# Altium schematic sheet FC_v2.0_Schematic.SchDoc
size 431 x 292 mm
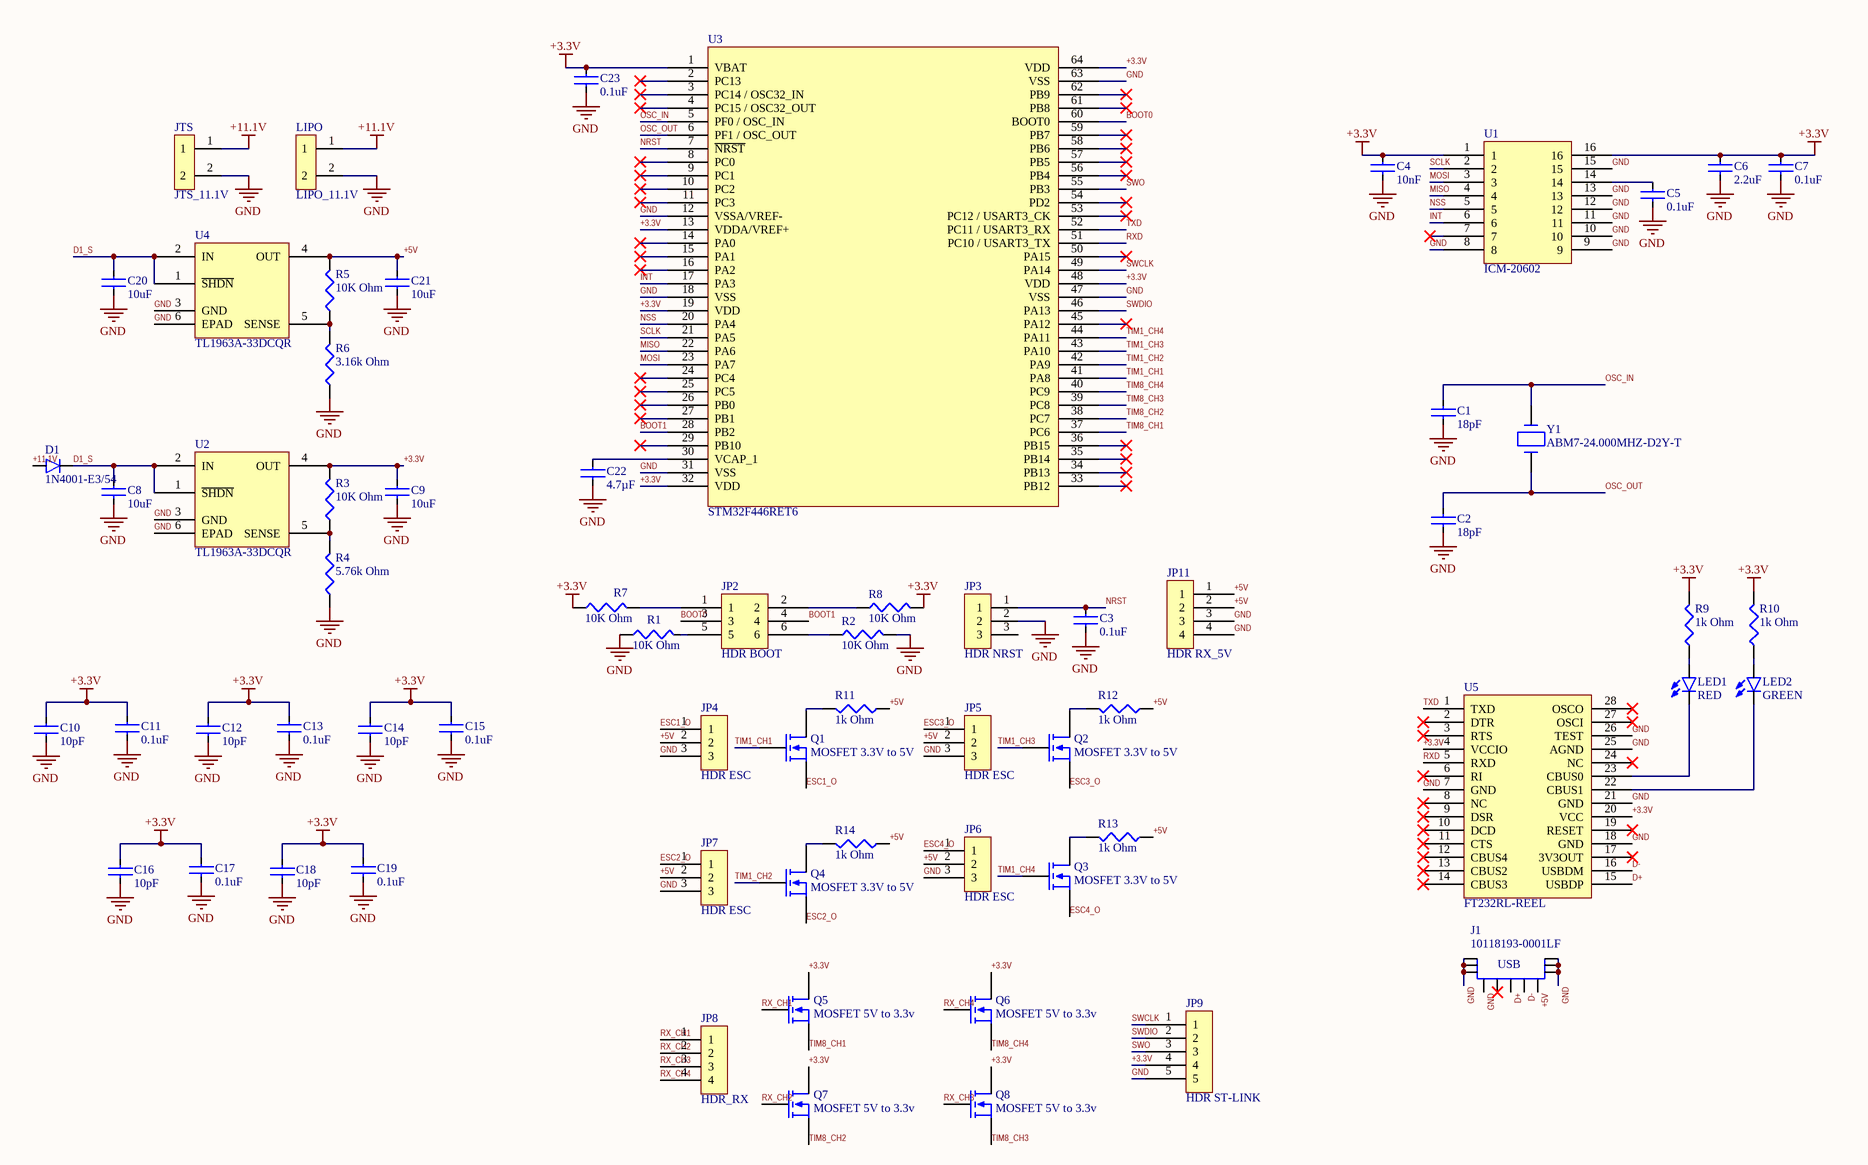
[diagram p0: FC_v2.0_Schematic.SchDoc]

## Parts
C1  18pF  [C0805]
C2  18pF  [C0805]
C3  0.1uF  [C0805]
C4  10nF  [C0805]
C5  0.1uF  [C0805]
C6  2.2uF  [C0805]
C7  0.1uF  [C0805]
C8  10uF  [C0805]
C9  10uF  [C0805]
C10  10pF  [C0805]
C11  0.1uF  [C0805]
C12  10pF  [C0805]
C13  0.1uF  [C0805]
C14  10pF  [C0805]
C15  0.1uF  [C0805]
C16  10pF  [C0805]
C17  0.1uF  [C0805]
C18  10pF  [C0805]
C19  0.1uF  [C0805]
C20  10uF  [C0805]
C21  10uF  [C0805]
C22  4.7µF  [C0805]
C23  0.1uF  [C0805]
D1  1N4001-E3/54  [DIODE]
J1  10118193-0001LF  [10118193]
JP2  HDR BOOT  [HDR_MALE_BOOT]
JP3  HDR NRST  [HDR_Male_NRST]
JP4  HDR ESC  [HDR_Male_ESC]
JP5  HDR ESC  [HDR_Male_ESC]
JP6  HDR ESC  [HDR_Male_ESC]
JP7  HDR ESC  [HDR_Male_ESC]
JP8  HDR_RX  [HDR_Male_RX]
JP9  HDR ST-LINK  [HDR_Male_ST-LINK]
JP11  HDR RX_5V  [HDR_Male_RX_5V]
JTS  JTS_11.1V  [JTS_11.1V]
LED1  RED  [LED]
LED2  GREEN  [LED]
LIPO  LIPO_11.1V  [LIPO_11.1V]
Q1  MOSFET 3.3V to 5V  [MOSFET]
Q2  MOSFET 3.3V to 5V  [MOSFET]
Q3  MOSFET 3.3V to 5V  [MOSFET]
Q4  MOSFET 3.3V to 5V  [MOSFET]
Q5  MOSFET 5V to 3.3v  [MOSFET]
Q6  MOSFET 5V to 3.3v  [MOSFET]
Q7  MOSFET 5V to 3.3v  [MOSFET]
Q8  MOSFET 5V to 3.3v  [MOSFET]
R1  10K Ohm  [R0805]
R2  10K Ohm  [R0805]
R3  10K Ohm  [R0805]
R4  5.76k Ohm  [R0805]
R5  10K Ohm  [R0805]
R6  3.16k Ohm  [R0805]
R7  10K Ohm  [R0805]
R8  10K Ohm  [R0805]
R9  1k Ohm  [R0805]
R10  1k Ohm  [R0805]
R11  1k Ohm  [R0805]
R12  1k Ohm  [R0805]
R13  1k Ohm  [R0805]
R14  1k Ohm  [R0805]
U1  ICM-20602  [LGA]
U2  TL1963A-33DCQR  [DCQ]
U3  STM32F446RET6  [STM32F446xC]
U4  TL1963A-33DCQR  [DCQ]
U5  FT232RL-REEL  [SSOP_28]
Y1  ABM7-24.000MHZ-D2Y-T  [AMB7_v1_0_BIG]

## Nets
+3.3V: C4.1 C6.1 C7.1 C9.1 C10.1 C11.1 C12.1 C13.1 C14.1 C15.1 C16.1 C17.1 C18.1 C19.1 C23.1 JP9.4 Q5.3 Q6.3 Q7.3 Q8.3 R3.2 R7.1 R8.2 R9.2 R10.2 U1.1 U1.16 U2.4(OUT) U3.1(VBAT) U3.13(VDDA/VREF+) U3.19(VDD) U3.32(VDD) U3.48(VDD) U3.64(VDD) U5.4(VCCIO) U5.20(VCC)
+11.1V: D1.1 JTS.1 LIPO.1
GND: C1.2 C2.2 C3.2 C4.2 C5.2 C6.2 C7.2 C8.2 C9.2 C10.2 C11.2 C12.2 C13.2 C14.2 C15.2 C16.2 C17.2 C18.2 C19.2 C20.2 C21.2 C22.2 C23.2 J1.5 J1.6 J1.7 J1.8 J1.9 J1.10 J1.11 JP3.2 JP4.3 JP5.3 JP6.3 JP7.3 JP9.5 JP11.3 JP11.4 JTS.2 LIPO.2 R1.1 R2.1 R4.1 R6.1 U1.8 U1.9 U1.10 U1.11 U1.12 U1.13 U1.15 U2.3(GND) U2.6(EPAD) U3.12(VSSA/VREF-) U3.18(VSS) U3.31(VSS) U3.47(VSS) U3.63(VSS) U4.3(GND) U4.6(EPAD) U5.7(GND) U5.18(GND) U5.21(GND) U5.25(AGND) U5.26(TEST)
+5V: C21.1 J1.1 JP4.2 JP5.2 JP6.2 JP7.2 JP11.1 JP11.2 R5.2 R11.1 R12.1 R13.1 R14.1 U4.4(OUT)
BOOT0: JP2.3 U3.60(BOOT0)
BOOT1: JP2.4 U3.28(PB2)
D1_S: C8.1 C20.1 D1.2 U2.1(~{SHDN}) U2.2(IN) U4.1(~{SHDN}) U4.2(IN)
D+: J1.3 U5.15(USBDP)
D-: J1.2 U5.16(USBDM)
ESC1_O: JP4.1 Q1.2
ESC2_O: JP7.1 Q4.2
ESC3_O: JP5.1 Q2.2
ESC4_O: JP6.1 Q3.2
INT: U1.6 U3.17(PA3)
MISO: U1.4 U3.22(PA6)
MOSI: U1.3 U3.23(PA7)
NRST: C3.1 JP3.1 U3.7(~{NRST})
NSS: U1.5 U3.20(PA4)
OSC_IN: C1.1 U3.5(PF0_/_OSC_IN) Y1.2
OSC_OUT: C2.1 U3.6(PF1_/_OSC_OUT) Y1.1
RX_CH1: JP8.1 Q5.1
RX_CH2: JP8.2 Q7.1
RX_CH3: JP8.3 Q8.1
RX_CH4: JP8.4 Q6.1
RXD: U3.51(PC10_/_USART3_TX) U5.5(RXD)
SCLK: U1.2 U3.21(PA5)
SWCLK: JP9.1 U3.49(PA14)
SWDIO: JP9.2 U3.46(PA13)
SWO: JP9.3 U3.55(PB3)
TIM1_CH1: Q1.1 U3.41(PA8)
TIM1_CH2: Q4.1 U3.42(PA9)
TIM1_CH3: Q2.1 U3.43(PA10)
TIM1_CH4: Q3.1 U3.44(PA11)
TIM8_CH1: Q5.2 U3.37(PC6)
TIM8_CH2: Q7.2 U3.38(PC7)
TIM8_CH3: Q8.2 U3.39(PC8)
TIM8_CH4: Q6.2 U3.40(PC9)
TXD: U3.52(PC11_/_USART3_RX) U5.1(TXD)
NetC5_1: C5.1 U1.14
NetC22_1: C22.1 U3.30(VCAP_1)
NetJP2_1: JP2.1 R7.2
NetJP2_2: JP2.2 R8.1
NetJP2_5: JP2.5 R1.2
NetJP2_6: JP2.6 R2.2
NetLED1_1: LED1.1 R9.1
NetLED1_2: LED1.2 U5.23(CBUS0)
NetLED2_1: LED2.1 R10.1
NetLED2_2: LED2.2 U5.22(CBUS1)
NetQ1_3: Q1.3 R11.2
NetQ2_3: Q2.3 R12.2
NetQ3_3: Q3.3 R13.2
NetQ4_3: Q4.3 R14.2
NetR3_1: R3.1 R4.2 U2.5(SENSE)
NetR5_1: R5.1 R6.2 U4.5(SENSE)

Not connected (* = marked no-connect by the designer): J1 4*; JP3 3; U1 7*; U3 2(PC13)* 3(PC14_/_OSC32_IN)* 4(PC15_/_OSC32_OUT)* 8(PC0)* 9(PC1)* 10(PC2)* 11(PC3)* 14(PA0)* 15(PA1)* 16(PA2)* 24(PC4)* 25(PC5)* 26(PB0)* 27(PB1)* 29(PB10)* 33(PB12)* 34(PB13)* 35(PB14)* 36(PB15)* 45(PA12)* 50(PA15)* 53(PC12_/_USART3_CK)* 54(PD2)* 56(PB4)* 57(PB5)* 58(PB6)* 59(PB7)* 61(PB8)* 62(PB9)*; U5 2(DTR)* 3(RTS)* 6(RI)* 8(NC)* 9(DSR)* 10(DCD)* 11(CTS)* 12(CBUS4)* 13(CBUS2)* 14(CBUS3)* 17(3V3OUT)* 19(RESET)* 24(NC)* 27(OSCI)* 28(OSCO)*

## Notes on the sheet
- (in symbol 10118193-0001LF) USB

## Library data of the parts
C1 C2 = CL21C180JBANNNC: Cap Ceramic 18pF 50V C0G 5% SMD 0805 125C Paper T/R; Manufacturer: Samsung; Supplier 1: Digi-Key; Manufacturer Part Number: CL21C180JBANNNC; Stock 1: 210005; Pricing 1: 1=0.1, 10=0.048, 100=0.0216, 500=0.0154, 1000=0.0121 (USD); Capacitance: 18 pF; Case Size/Dimension: 0805; Dielectric: C0G; Tolerance (%): ±5 %; Rated Voltage: 50 V; ComponentLink1URL: https://datasheet.ciiva.com/25801/cl21c180jbannnc-25801747.pdf; ComponentLink1Description: https://datasheet.ciiva.com/25801/cl21c180jbannnc-25801747.pdf; ComponentLink2URL: https://datasheet.ciiva.com/16216/cl05b104kq5nnnc-16216390.pdf; ComponentLink2Description: https://datasheet.ciiva.com/16216/cl05b104kq5nnnc-16216390.pdf; ComponentLink3URL: https://datasheet.ciiva.com/26838/getdatasheetpartid-666022-26838764.pdf; ComponentLink3Description: https://datasheet.ciiva.com/26838/getdatasheetpartid-666022-26838764.pdf; ComponentLink4URL: https://datasheet.ciiva.com/29199/454764-da-01-en-vs-kondensator-0805-29199527.pdf; ComponentLink4Description: https://datasheet.ciiva.com/29199/454764-da-01-en-vs-kondensator-0805-29199527.pdf; Supplier Part Number 1: 1276-1107-1-ND
C3 C5 C7 C11 C13 C15 C17 C19 C23 = CL21B104KOANNNC: Cap Ceramic 0.1uF 16V X7R 10% SMD 0805 125C Paper T/R; Manufacturer: Samsung; Capacitance: 0.1 µF; Supplier 1: Digi-Key; Manufacturer Part Number: CL21B104KOANNNC; Stock 1: 97502; Pricing 1: 1=0.1, 10=0.03, 100=0.0133, 500=0.0095, 1000=0.0074 (USD); Case Size/Dimension: 0805; Dielectric: X7R; Tolerance (%): ±10 %; Rated Voltage: 16 V; ComponentLink1URL: https://datasheet.ciiva.com/25737/cl21b104koannnc-25737216.pdf; ComponentLink1Description: https://datasheet.ciiva.com/25737/cl21b104koannnc-25737216.pdf; ComponentLink2URL: https://datasheet.ciiva.com/16428/cl21b104koannnc-16428868.pdf; ComponentLink2Description: https://datasheet.ciiva.com/16428/cl21b104koannnc-16428868.pdf; Supplier Part Number 1: 1276-2448-6-ND
C4 = CC0805KRX7R9BB103: CAP CER 10000PF 50V X7R 0805; Manufacturer: Yageo; Product Training Modules: Multilayer Ceramic Capacitors; Catalog Drawings: CC_0805_0.6; Featured Product: Commodity Multilayer Ceramic Capacitors – CC Series; Tolerance: ±10%; Online Catalog: CC Series; Other Names: 311-1136-6; Supplier 1: Digi-Key; Manufacturer Part Number: CC0805KRX7R9BB103; Stock 1: 1187328; Pricing 1: 1=0.1, 10=0.035, 100=0.0158, 500=0.0113, 1000=0.0089 (USD); Standard Package: 1; Category: Capacitors; Family: Ceramic Capacitors; Series: CC; Packaging: Digi-Reel®; Capacitance: 10000pF; Voltage - Rated: 50V; Temperature Coefficient: X7R; Mounting Type: Surface Mount, MLCC; Operating Temperature: -55°C ~ 125°C; Applications: General Purpose; Ratings: -; Package / Case: 0805 (2012 Metric); Size / Dimension: 0.079" L x 0.049" W (2.00mm x 1.25mm); Height - Seated (Max): -; Thickness (Max): 0.024" (0.60mm); Lead Spacing: -; Features: -; Lead Style: -; ComponentLink1URL: https://datasheet.ciiva.com/144/mlccorderingcode-144532.pdf; ComponentLink1Description: https://datasheet.ciiva.com/144/mlccorderingcode-144532.pdf; ComponentLink2URL: https://datasheet.ciiva.com/144/mlccorderingcode-144533.pdf; ComponentLink2Description: https://datasheet.ciiva.com/144/mlccorderingcode-144533.pdf; ComponentLink3URL: https://datasheet.ciiva.com/144/mlccorderingcode-144534.pdf; ComponentLink3Description: https://datasheet.ciiva.com/144/mlccorderingcode-144534.pdf; ComponentLink4URL: https://datasheet.ciiva.com/11786/0900766b80d84f1d-11786119.pdf; ComponentLink4Description: https://datasheet.ciiva.com/11786/0900766b80d84f1d-11786119.pdf; ComponentLink5URL: https://datasheet.ciiva.com/25613/0900766b8027bcf6-25613113.pdf; ComponentLink5Description: https://datasheet.ciiva.com/25613/0900766b8027bcf6-25613113.pdf; ComponentLink6URL: https://datasheet.ciiva.com/16625/upy-gphc-x7r-6-3v-to-50v-8-16625548.pdf; ComponentLink6Description: https://datasheet.ciiva.com/16625/upy-gphc-x7r-6-3v-to-50v-8-16625548.pdf; ComponentLink7URL: https://datasheet.ciiva.com/46372/1784427-46372638.pdf; ComponentLink7Description: https://datasheet.ciiva.com/46372/1784427-46372638.pdf; ComponentLink8URL: https://datasheet.ciiva.com/22749/1489800-22749215.pdf; ComponentLink8Description: https://datasheet.ciiva.com/22749/1489800-22749215.pdf; ComponentLink9URL: https://datasheet.ciiva.com/46372/1734573-46372639.pdf; ComponentLink9Description: https://datasheet.ciiva.com/46372/1734573-46372639.pdf; Supplier Part Number 1: 311-1136-1-ND
C6 = EMK212BJ225KG-T: CAP CER 2.2UF 16V X5R 0805; Manufacturer: Taiyo Yuden; PCN Part Number: X5R, X7R Dielectrics 23/Jan/2008; Catalog Drawings: xMK Series_0805_1.25; Capacitance: 2.2µF; Tolerance: ±10%; Online Catalog: M Series; Kits: 587-1797-KIT-ND  - KIT CAP CER HI CAP 0603 & 0805 S; Other Names: 587-1293-1; Supplier 1: Digi-Key; Manufacturer Part Number: EMK212BJ225KG-T; Stock 1: 391933; Pricing 1: 1=0.16, 10=0.114, 100=0.0534, 500=0.0374, 1000=0.031 (USD); Standard Package: 1; Category: Capacitors; Family: Ceramic Capacitors; Series: M; Packaging: Cut Tape (CT); Voltage - Rated: 16V; Temperature Coefficient: X5R; Mounting Type: Surface Mount, MLCC; Operating Temperature: -55°C ~ 85°C; Applications: General Purpose; Ratings: -; Package / Case: 0805 (2012 Metric); Size / Dimension: 0.079" L x 0.049" W (2.00mm x 1.25mm); Height - Seated (Max): -; Thickness (Max): 0.053" (1.35mm); Lead Spacing: -; Features: -; Lead Style: -; ComponentLink1URL: https://datasheet.ciiva.com/136/emk212bj225kg-t-ss-136098.pdf; ComponentLink1Description: https://datasheet.ciiva.com/136/emk212bj225kg-t-ss-136098.pdf; ComponentLink2URL: https://datasheet.ciiva.com/15920/993emk212bj225kg-t-15920531.pdf; ComponentLink2Description: https://datasheet.ciiva.com/15920/993emk212bj225kg-t-15920531.pdf; ComponentLink3URL: https://datasheet.ciiva.com/26871/getdatasheetpartid-637381-26871380.pdf; ComponentLink3Description: https://datasheet.ciiva.com/26871/getdatasheetpartid-637381-26871380.pdf; ComponentLink4URL: https://datasheet.ciiva.com/5815/1693457-5815977.pdf; ComponentLink4Description: https://datasheet.ciiva.com/5815/1693457-5815977.pdf; ComponentLink5URL: https://datasheet.ciiva.com/30078/125emk212bj225kg-t-30078029.pdf; ComponentLink5Description: https://datasheet.ciiva.com/30078/125emk212bj225kg-t-30078029.pdf; ComponentLink6URL: https://datasheet.ciiva.com/7975/1497285-7975646.pdf; ComponentLink6Description: https://datasheet.ciiva.com/7975/1497285-7975646.pdf; Supplier Part Number 1: 587-1293-1-ND
C8 C9 C20 C21 = CL21A106KOQNNNE: Cap Ceramic 10uF 16V X5R 10% SMD 0805 85C T/R; Manufacturer: Samsung; Capacitance: 10000000 pF; Supplier 1: Digi-Key; Manufacturer Part Number: CL21A106KOQNNNE; Stock 1: 508450; Pricing 1: 1=0.21, 10=0.149, 100=0.0702, 500=0.0492, 1000=0.0408 (USD); Case Size/Dimension: 0805; Dielectric: X5R; Tolerance (%): ±10 %; Rated Voltage: 16 V; ComponentLink1URL: https://datasheet.ciiva.com/25798/cl21a106koqnnne-25798133.pdf; ComponentLink1Description: https://datasheet.ciiva.com/25798/cl21a106koqnnne-25798133.pdf; ComponentLink2URL: https://datasheet.ciiva.com/16740/cl05b104kq5nnnc-16740697.pdf; ComponentLink2Description: https://datasheet.ciiva.com/16740/cl05b104kq5nnnc-16740697.pdf; ComponentLink3URL: https://datasheet.ciiva.com/15216/getdatasheetpartid-358435-15216234.pdf; ComponentLink3Description: https://datasheet.ciiva.com/15216/getdatasheetpartid-358435-15216234.pdf; Supplier Part Number 1: 1276-1096-1-ND
C10 C12 C14 C16 C18 = C0805C100M4GACTU_1: Multilayer Ceramic Capacitors MLCC - SMD/SMT 16volts 10pF C0G 20%; Manufacturer: KEMET; Capacitor Case Style: 0805 [2012 Metric]; Dielectric Characteristic: C0G / NP0; Product Range: KEMET - C Series; SVHC: No SVHC (16-Jun-2014); Voltage Rating: 16V; Supplier 1: Digi-Key; Manufacturer Part Number: C0805C100M4GACTU; Stock 1: 12641; Pricing 1: 1=0.1, 10=0.064, 100=0.0285, 500=0.0204, 1000=0.016 (USD); Capacitance: 10pF; Capacitance Tolerance: ± 20%; Ceramic Capacitor Case: 0805 [2012 Metric]; MSL: MSL 1 - Unlimited; Operating Temperature Max: 125°C; Operating Temperature Min: -55°C; Packaging: Cut Tape; ComponentLink1URL: http://www.kemet.com/Lists/ProductCatalog/Attachments/46/KEM_C1003_C0G_SMD.pdf; ComponentLink1Description: http://www.kemet.com/Lists/ProductCatalog/Attachments/46/KEM_C1003_C0G_SMD.pdf; ComponentLink2URL: http://www.kemet.com/docfinder?Partnumber=C0805C100M4GACTU; ComponentLink2Description: http://www.kemet.com/docfinder?Partnumber=C0805C100M4GACTU; ComponentLink3URL: http://capacitoredge.kemet.com/capedge2/DataSheet?pn=C0805C100M4GACTU; ComponentLink3Description: http://capacitoredge.kemet.com/capedge2/DataSheet?pn=C0805C100M4GACTU; Supplier Part Number 1: 399-9147-1-ND
C22 = CC0805KKX7R8BB475: Multilayer Ceramic Capacitors MLCC - SMD/SMT 4.7M pF 10% 25 Volts; Manufacturer: Yageo; Voltage - Rated: 25V; Temperature Coefficient: X7R; Supplier 1: Digi-Key; Manufacturer Part Number: CC0805KKX7R8BB475; Stock 1: 8314; Pricing 1: 1=0.38, 10=0.263, 100=0.1578, 500=0.1183, 1000=0.0999 (USD); Category: Capacitors; Family: Ceramic Capacitors; Series: CC; Packaging: Tape &amp; Reel (TR); Capacitance: 4.7µF; Tolerance: ±10%; Mounting Type: Surface Mount, MLCC; Operating Temperature: -55°C ~ 125°C; Applications: General Purpose; Ratings: -; Package / Case: 0805 (2012 Metric); Size / Dimension: 0.079" L x 0.049" W (2.00mm x 1.25mm); Height - Seated (Max): -; Thickness (Max): 0.057" (1.45mm); Lead Spacing: -; Features: -; Lead Style: -; ComponentLink1URL: http://www.mouser.com/ds/2/447/Yageo_UPY-GP_NP0_16V-to-50V_9-358835.pdf; ComponentLink1Description: http://www.mouser.com/ds/2/447/Yageo_UPY-GP_NP0_16V-to-50V_9-358835.pdf; ComponentLink2URL: http://www.yageo.com/documents/recent/UPY-GPHC_X7R_6.3V-to-50V_18.pdf; ComponentLink2Description: http://www.yageo.com/documents/recent/UPY-GPHC_X7R_6.3V-to-50V_18.pdf; Supplier Part Number 1: 311-1885-1-ND
D1 = 1N4001-E3/73: Rectifiers Vr/50V Io/1A; Manufacturer: Vishay Semiconductors; Configuration: Single; Forward Voltage Drop: 1.1 V; Forward Continuous Current: 1 A; Max Surge Current: 30 A; Reverse Voltage: 50 V; Reverse Current IR: 5 uA; Supplier 1: Digi-Key; Manufacturer Part Number: 1N4001-E3/73; Stock 1: 13599; Pricing 1: 1=0.26, 10=0.209, 25=0.1752, 100=0.111, 250=0.0856, 500=0.073, 1000=0.0496 (USD); Factory Pack Quantity: 3000; Product Category: Rectifiers; Product: Standard Recovery Rectifiers; Mounting Style: Through Hole; Package / Case: DO-41; Packaging: Ammo; Maximum Operating Temperature: + 150 C; Minimum Operating Temperature: - 50 C; Part # Aliases: 1N4001-E3/54; RoHS: Details; ComponentLink1URL: https://datasheet.ciiva.com/15190/getdatasheetpartid-362633-15190388.pdf; ComponentLink1Description: https://datasheet.ciiva.com/15190/getdatasheetpartid-362633-15190388.pdf; ComponentLink2URL: https://datasheet.ciiva.com/46383/1911658-46383800.pdf; ComponentLink2Description: https://datasheet.ciiva.com/46383/1911658-46383800.pdf; ComponentLink3URL: https://datasheet.ciiva.com/25936/1n4001-25936157.pdf; ComponentLink3Description: https://datasheet.ciiva.com/25936/1n4001-25936157.pdf; ComponentLink4URL: https://datasheet.ciiva.com/22685/1911658-22685727.pdf; ComponentLink4Description: https://datasheet.ciiva.com/22685/1911658-22685727.pdf; Supplier Part Number 1: 1N4001-E3/73GICT-ND
J1 = 10118193-0001LF: USB - micro B USB 2.0 Receptacle Connector 5 Position Surface Mount, Right Angle, Horizontal; Manufacturer: Amphenol FCI; Number of Contacts: 5 Contact; Gender: Female; Current Rating: 1.8 A; Brand: FCI; Connector Type: Micro USB Type B receptacle; Insulation Resistance: 1000 MOhms; Supplier 1: Digi-Key; Manufacturer Part Number: 10118193-0001LF; Stock 1: 72264; Pricing 1: 1=0.46, 10=0.437, 25=0.3744, 50=0.318, 100=0.3056, 250=0.2744, 500=0.262 (USD); Product Category: USB Connectors; RoHS: Details; Product: Micro USB Type B Connectors; Standard: USB 2.0; Termination Style: SMD/SMT; Color: Black; Contact Material: Copper Alloy; Contact Plating: Gold; Flammability Rating: UL 94 V-0; Mounting Angle: Right; Operating Temperature Range: - 55 C to + 85 C; Packaging: Reel; Factory Pack Quantity: 1200; ComponentLink1URL: https://datasheet.ciiva.com/851/10118193-851106.pdf; ComponentLink1Description: https://datasheet.ciiva.com/851/10118193-851106.pdf; ComponentLink2URL: https://datasheet.ciiva.com/14802/10118193-0001lf-webpage-14802386.pdf; ComponentLink2Description: https://datasheet.ciiva.com/14802/10118193-0001lf-webpage-14802386.pdf; ComponentLink3URL: https://datasheet.ciiva.com/851/10118193-851107.pdf; ComponentLink3Description: https://datasheet.ciiva.com/851/10118193-851107.pdf; ComponentLink4URL: https://datasheet.ciiva.com/851/10118193-851108.pdf; ComponentLink4Description: https://datasheet.ciiva.com/851/10118193-851108.pdf; ComponentLink5URL: https://datasheet.ciiva.com/26853/getdatasheetpartid-418618-26853893.pdf; ComponentLink5Description: https://datasheet.ciiva.com/26853/getdatasheetpartid-418618-26853893.pdf; ComponentLink6URL: https://datasheet.ciiva.com/14618/70236827-14618887.pdf; ComponentLink6Description: https://datasheet.ciiva.com/14618/70236827-14618887.pdf; ComponentLink7URL: https://datasheet.ciiva.com/4598/10118193ac-197151-4598799.pdf; ComponentLink7Description: https://datasheet.ciiva.com/4598/10118193ac-197151-4598799.pdf; Supplier Part Number 1: 609-4616-1-ND
JP2 = 68001-204HLF_BOOT: 4 Positions Header, Unshrouded Connector 0.100" (2.54mm) Through Hole Gold or Gold, GXT™; Manufacturer: Amphenol FCI; Rad Hard: No; Number of Contacts: 4; Supplier 1: Digi-Key; Manufacturer Part Number: 68001-204HLF; Stock 1: 9668; Pricing 1: 1=0.35, 10=0.331, 100=0.2315, 500=0.1985, 1000=0.1654, 5000=0.1418, 10000=0.1323 (USD); Packaging: Bulk; Type: Unshrouded Header; Pitch: 2.54 mm; Number of Rows: 1; Gender: HDR; Contact Plating: Gold Over Nickel|GXT Over Nickel; Termination Method: Solder; Category: Connector Headers and PCB Receptacles; ComponentLink1URL: https://datasheet.ciiva.com/726/68000-726529.pdf; ComponentLink1Description: https://datasheet.ciiva.com/726/68000-726529.pdf; ComponentLink2URL: https://datasheet.ciiva.com/5164/68000-274255-5164127.pdf; ComponentLink2Description: https://datasheet.ciiva.com/5164/68000-274255-5164127.pdf; Supplier Part Number 1: 609-3402-ND
JP3 = 68001-204HLF_NRST: 4 Positions Header, Unshrouded Connector 0.100" (2.54mm) Through Hole Gold or Gold, GXT™; Manufacturer: Amphenol FCI; Rad Hard: No; Number of Contacts: 4; Supplier 1: Digi-Key; Manufacturer Part Number: 68001-204HLF; Stock 1: 9668; Pricing 1: 1=0.35, 10=0.331, 100=0.2315, 500=0.1985, 1000=0.1654, 5000=0.1418, 10000=0.1323 (USD); Packaging: Bulk; Type: Unshrouded Header; Pitch: 2.54 mm; Number of Rows: 1; Gender: HDR; Contact Plating: Gold Over Nickel|GXT Over Nickel; Termination Method: Solder; Category: Connector Headers and PCB Receptacles; ComponentLink1URL: https://datasheet.ciiva.com/726/68000-726529.pdf; ComponentLink1Description: https://datasheet.ciiva.com/726/68000-726529.pdf; ComponentLink2URL: https://datasheet.ciiva.com/5164/68000-274255-5164127.pdf; ComponentLink2Description: https://datasheet.ciiva.com/5164/68000-274255-5164127.pdf; Supplier Part Number 1: 609-3402-ND
JP4-JP7 = 68001-204HLF_ESC: 4 Positions Header, Unshrouded Connector 0.100" (2.54mm) Through Hole Gold or Gold, GXT™; Manufacturer: Amphenol FCI; Rad Hard: No; Number of Contacts: 4; Supplier 1: Digi-Key; Manufacturer Part Number: 68001-204HLF; Stock 1: 9668; Pricing 1: 1=0.35, 10=0.331, 100=0.2315, 500=0.1985, 1000=0.1654, 5000=0.1418, 10000=0.1323 (USD); Packaging: Bulk; Type: Unshrouded Header; Pitch: 2.54 mm; Number of Rows: 1; Gender: HDR; Contact Plating: Gold Over Nickel|GXT Over Nickel; Termination Method: Solder; Category: Connector Headers and PCB Receptacles; ComponentLink1URL: https://datasheet.ciiva.com/726/68000-726529.pdf; ComponentLink1Description: https://datasheet.ciiva.com/726/68000-726529.pdf; ComponentLink2URL: https://datasheet.ciiva.com/5164/68000-274255-5164127.pdf; ComponentLink2Description: https://datasheet.ciiva.com/5164/68000-274255-5164127.pdf; Supplier Part Number 1: 609-3402-ND
JP8 = 68001-204HLF_RX: 4 Positions Header, Unshrouded Connector 0.100" (2.54mm) Through Hole Gold or Gold, GXT™; Manufacturer: Amphenol FCI; Rad Hard: No; Number of Contacts: 4; Gender: HDR; Supplier 1: Digi-Key; Manufacturer Part Number: 68001-204HLF; Stock 1: 9668; Pricing 1: 1=0.35, 10=0.331, 100=0.2315, 500=0.1985, 1000=0.1654, 5000=0.1418, 10000=0.1323 (USD); Packaging: Bulk; Type: Unshrouded Header; Pitch: 2.54 mm; Number of Rows: 1; Contact Plating: Gold Over Nickel|GXT Over Nickel; Termination Method: Solder; Category: Connector Headers and PCB Receptacles; ComponentLink1URL: https://datasheet.ciiva.com/726/68000-726529.pdf; ComponentLink1Description: https://datasheet.ciiva.com/726/68000-726529.pdf; ComponentLink2URL: https://datasheet.ciiva.com/5164/68000-274255-5164127.pdf; ComponentLink2Description: https://datasheet.ciiva.com/5164/68000-274255-5164127.pdf; Supplier Part Number 1: 609-3402-ND
JP9 = 68001-204HLF_ST-LINK: 4 Positions Header, Unshrouded Connector 0.100" (2.54mm) Through Hole Gold or Gold, GXT™; Manufacturer: Amphenol FCI; Rad Hard: No; Number of Contacts: 4; Supplier 1: Digi-Key; Manufacturer Part Number: 68001-204HLF; Stock 1: 9668; Pricing 1: 1=0.35, 10=0.331, 100=0.2315, 500=0.1985, 1000=0.1654, 5000=0.1418, 10000=0.1323 (USD); Packaging: Bulk; Type: Unshrouded Header; Pitch: 2.54 mm; Number of Rows: 1; Gender: HDR; Contact Plating: Gold Over Nickel|GXT Over Nickel; Termination Method: Solder; Category: Connector Headers and PCB Receptacles; ComponentLink1URL: https://datasheet.ciiva.com/726/68000-726529.pdf; ComponentLink1Description: https://datasheet.ciiva.com/726/68000-726529.pdf; ComponentLink2URL: https://datasheet.ciiva.com/5164/68000-274255-5164127.pdf; ComponentLink2Description: https://datasheet.ciiva.com/5164/68000-274255-5164127.pdf; Supplier Part Number 1: 609-3402-ND
JP11 = 68001-204HLF_RX_5V: 4 Positions Header, Unshrouded Connector 0.100" (2.54mm) Through Hole Gold or Gold, GXT™; Manufacturer: Amphenol FCI; Rad Hard: No; Number of Contacts: 4; Supplier 1: Digi-Key; Manufacturer Part Number: 68001-204HLF; Stock 1: 9668; Pricing 1: 1=0.35, 10=0.331, 100=0.2315, 500=0.1985, 1000=0.1654, 5000=0.1418, 10000=0.1323 (USD); Packaging: Bulk; Type: Unshrouded Header; Pitch: 2.54 mm; Number of Rows: 1; Gender: HDR; Contact Plating: Gold Over Nickel|GXT Over Nickel; Termination Method: Solder; Category: Connector Headers and PCB Receptacles; ComponentLink1URL: https://datasheet.ciiva.com/726/68000-726529.pdf; ComponentLink1Description: https://datasheet.ciiva.com/726/68000-726529.pdf; ComponentLink2URL: https://datasheet.ciiva.com/5164/68000-274255-5164127.pdf; ComponentLink2Description: https://datasheet.ciiva.com/5164/68000-274255-5164127.pdf; Supplier Part Number 1: 609-3402-ND
LED1 = SML-M13VTT86: LED RED CLEAR 0805 SMD; Manufacturer: Rohm; Brand: ROHM Semiconductor; LED Size: 2 mm x 1.25 mm x 0.8 mm; Forward Current: 20 mA; Forward Voltage: 2 V; Luminous Intensity: 75 mcd; Wavelength/Color Temperature: 630 nm; Supplier 1: Digi-Key; Manufacturer Part Number: SML-M13VTT86; Stock 1: 9242; Pricing 1: 1=0.66, 10=0.475, 25=0.388, 100=0.3105, 250=0.262, 500=0.2231, 1000=0.1746 (USD); Factory Pack Quantity: 3000; Illumination Color: Red; Product Category: Standard LEDs - SMD; RoHS: Details; Package / Case: 0805 (2012 metric); Packaging: Reel; Maximum Operating Temperature: + 85 C; Minimum Operating Temperature: - 40 C; ComponentLink1URL: https://datasheet.ciiva.com/2111/sml-m1-2111141.pdf; ComponentLink1Description: https://datasheet.ciiva.com/2111/sml-m1-2111141.pdf; ComponentLink2URL: https://datasheet.ciiva.com/2111/sml-m1-2111142.pdf; ComponentLink2Description: https://datasheet.ciiva.com/2111/sml-m1-2111142.pdf; ComponentLink3URL: https://datasheet.ciiva.com/2111/sml-m1-2111143.pdf; ComponentLink3Description: https://datasheet.ciiva.com/2111/sml-m1-2111143.pdf; Supplier Part Number 1: 846-1031-1-ND
LED2 = SML-M13PTT86: LED GREEN CLEAR 0805 SMD; Manufacturer: Rohm; Brand: ROHM Semiconductor; LED Size: 2 mm x 1.25 mm x 0.8 mm; Forward Current: 20 mA; Forward Voltage: 2.2 V; Luminous Intensity: 16 mcd; Wavelength/Color Temperature: 560 nm; Supplier 1: Digi-Key; Manufacturer Part Number: SML-M13PTT86; Stock 1: 6223; Pricing 1: 1=0.5, 10=0.394, 25=0.328, 100=0.2827, 250=0.2524, 500=0.2171, 1000=0.1676 (USD); Factory Pack Quantity: 3000; Illumination Color: Green; Product Category: Standard LEDs - SMD; RoHS: Details; Package / Case: 0805 (2012 metric); Packaging: Reel; Maximum Operating Temperature: + 85 C; Minimum Operating Temperature: - 40 C; ComponentLink1URL: https://datasheet.ciiva.com/2111/sml-m1-2111123.pdf; ComponentLink1Description: https://datasheet.ciiva.com/2111/sml-m1-2111123.pdf; ComponentLink2URL: https://datasheet.ciiva.com/2111/sml-m1-2111124.pdf; ComponentLink2Description: https://datasheet.ciiva.com/2111/sml-m1-2111124.pdf; ComponentLink3URL: https://datasheet.ciiva.com/2111/sml-m1-2111125.pdf; ComponentLink3Description: https://datasheet.ciiva.com/2111/sml-m1-2111125.pdf; Supplier Part Number 1: 846-1029-1-ND
Q1-Q4 = BSS138W: MOSFET 50V N-CH Logic Level; Manufacturer: Fairchild Semiconductor; Channel Type: N-Channel; Drain-Source On Resistance-Max: 3.5 O; Qg Gate Charge: 1.1 nC; Rated Power Dissipation: 340 mW; Supplier 1: Digi-Key; Manufacturer Part Number: BSS138W; Stock 1: 13378; Pricing 1: 1=0.44, 10=0.317, 100=0.1867, 500=0.1057, 1000=0.081 (USD); Drain-to-Source Voltage [Vdss]: 50 V; ComponentLink1URL: https://datasheet.ciiva.com/17170/bss138w-17170739.pdf; ComponentLink1Description: https://datasheet.ciiva.com/17170/bss138w-17170739.pdf; ComponentLink2URL: https://datasheet.ciiva.com/8115/bss138w-8115367.pdf; ComponentLink2Description: https://datasheet.ciiva.com/8115/bss138w-8115367.pdf; ComponentLink3URL: https://datasheet.ciiva.com/15043/bss138w-15043927.pdf; ComponentLink3Description: https://datasheet.ciiva.com/15043/bss138w-15043927.pdf; ComponentLink4URL: https://datasheet.ciiva.com/15043/bss138w-15043928.pdf; ComponentLink4Description: https://datasheet.ciiva.com/15043/bss138w-15043928.pdf; ComponentLink5URL: https://datasheet.ciiva.com/15043/bss138w-15043929.pdf; ComponentLink5Description: https://datasheet.ciiva.com/15043/bss138w-15043929.pdf; ComponentLink6URL: https://datasheet.ciiva.com/8115/bss138w-8115370.pdf; ComponentLink6Description: https://datasheet.ciiva.com/8115/bss138w-8115370.pdf; ComponentLink7URL: https://datasheet.ciiva.com/26146/bss138w-26146843.pdf; ComponentLink7Description: https://datasheet.ciiva.com/26146/bss138w-26146843.pdf; ComponentLink8URL: https://datasheet.ciiva.com/13042/bss138w-91619-13042909.pdf; ComponentLink8Description: https://datasheet.ciiva.com/13042/bss138w-91619-13042909.pdf; Supplier Part Number 1: BSS138WCT-ND
Q5-Q8 = BSS138W_1: MOSFET 50V N-CH Logic Level; Manufacturer: Fairchild Semiconductor; Channel Type: N-Channel; Drain-Source On Resistance-Max: 3.5 O; Qg Gate Charge: 1.1 nC; Rated Power Dissipation: 340 mW; Supplier 1: Digi-Key; Manufacturer Part Number: BSS138W; Stock 1: 13378; Pricing 1: 1=0.44, 10=0.317, 100=0.1867, 500=0.1057, 1000=0.081 (USD); Drain-to-Source Voltage [Vdss]: 50 V; ComponentLink1URL: https://datasheet.ciiva.com/17170/bss138w-17170739.pdf; ComponentLink1Description: https://datasheet.ciiva.com/17170/bss138w-17170739.pdf; ComponentLink2URL: https://datasheet.ciiva.com/8115/bss138w-8115367.pdf; ComponentLink2Description: https://datasheet.ciiva.com/8115/bss138w-8115367.pdf; ComponentLink3URL: https://datasheet.ciiva.com/15043/bss138w-15043927.pdf; ComponentLink3Description: https://datasheet.ciiva.com/15043/bss138w-15043927.pdf; ComponentLink4URL: https://datasheet.ciiva.com/15043/bss138w-15043928.pdf; ComponentLink4Description: https://datasheet.ciiva.com/15043/bss138w-15043928.pdf; ComponentLink5URL: https://datasheet.ciiva.com/15043/bss138w-15043929.pdf; ComponentLink5Description: https://datasheet.ciiva.com/15043/bss138w-15043929.pdf; ComponentLink6URL: https://datasheet.ciiva.com/8115/bss138w-8115370.pdf; ComponentLink6Description: https://datasheet.ciiva.com/8115/bss138w-8115370.pdf; ComponentLink7URL: https://datasheet.ciiva.com/26146/bss138w-26146843.pdf; ComponentLink7Description: https://datasheet.ciiva.com/26146/bss138w-26146843.pdf; ComponentLink8URL: https://datasheet.ciiva.com/13042/bss138w-91619-13042909.pdf; ComponentLink8Description: https://datasheet.ciiva.com/13042/bss138w-91619-13042909.pdf; Supplier Part Number 1: BSS138WCT-ND
R1-R3 R5 R7 R8 = RC0805JR-0710KL: YAGEO         RC0805JR-0710KL             RES, THICK FILM, 10K, 5%, 0.125W, 0805; Resistance: 10kohm; Voltage Rating: 150V; Resistor Case Style: 0805 [2012 Metric]; Power Rating: 250mW; Product Range: RC Series; Temperature Coefficient: ± 100ppm/°C; SVHC: To Be Advised; Supplier 1: Digi-Key; Manufacturer: Yageo; Manufacturer Part Number: RC0805JR-0710KL; Stock 1: 1415081; Pricing 1: 1=0.1, 10=0.019, 100=0.0076, 1000=0.0034, 2500=0.003 (USD); Resistance Tolerance: ± 5%; Packaging: Cut Tape; Resistor Element Type: Thick Film; Automotive Qualification Standard: -; MSL: MSL 1 - Unlimited; ComponentLink1URL: https://datasheet.ciiva.com/7983/444164-7983765.pdf; ComponentLink1Description: https://datasheet.ciiva.com/7983/444164-7983765.pdf; ComponentLink2URL: https://datasheet.ciiva.com/7941/444164-7941870.pdf; ComponentLink2Description: https://datasheet.ciiva.com/7941/444164-7941870.pdf; ComponentLink3URL: https://datasheet.ciiva.com/7941/444164-7941871.pdf; ComponentLink3Description: https://datasheet.ciiva.com/7941/444164-7941871.pdf; Supplier Part Number 1: 311-10KARCT-ND
R4 = ERJ-6ENF5761V: RESISTOR, THICK FILM, 5.76KOHM, 125mW, ± 1%; Manufacturer: Panasonic ECG; Resistance: 5.76 kOhms; Power Rating: 125 mW (1/8 W); Voltage Rating: 150 V; Brand: Panasonic; Qualification: AEC-Q200; Unit Weight: 0.000194 oz; Supplier 1: Digi-Key; Manufacturer Part Number: ERJ-6ENF5761V; Stock 1: 79878; Pricing 1: 1=0.1, 10=0.079, 100=0.0305, 1000=0.0134, 2500=0.0116 (USD); Product Category: Thick Film Resistors; RoHS: True; Tolerance: 1 %; Case Code - in: 0805; Case Code - mm: 2012; Operating Temperature Range: - 55 C to + 155 C; Series: ERJ; Type: Precision Thick Film Resistors SMD; Height: 0.6 mm; Length: 2 mm; Package / Case: 0805 (2012 metric); Packaging: Reel; Product: Thick Film Resistors SMD; Factory Pack Quantity: 5000; Termination Style: SMD/SMT; Width: 1.2 mm; ComponentLink1URL: https://datasheet.ciiva.com/7763/1678782-7763753.pdf; ComponentLink1Description: https://datasheet.ciiva.com/7763/1678782-7763753.pdf; ComponentLink2URL: https://datasheet.ciiva.com/30180/aoa0000ce2-30180170.pdf; ComponentLink2Description: https://datasheet.ciiva.com/30180/aoa0000ce2-30180170.pdf; ComponentLink3URL: https://datasheet.ciiva.com/46420/1678782-46420075.pdf; ComponentLink3Description: https://datasheet.ciiva.com/46420/1678782-46420075.pdf; ComponentLink4URL: https://datasheet.ciiva.com/22668/1678782-22668700.pdf; ComponentLink4Description: https://datasheet.ciiva.com/22668/1678782-22668700.pdf; ComponentLink5URL: https://datasheet.ciiva.com/24129/aoa0000ce2-24129708.pdf; ComponentLink5Description: https://datasheet.ciiva.com/24129/aoa0000ce2-24129708.pdf; ComponentLink6URL: https://datasheet.ciiva.com/9195/aoa0000ce2-9195263.pdf; ComponentLink6Description: https://datasheet.ciiva.com/9195/aoa0000ce2-9195263.pdf; Supplier Part Number 1: P5.76KCCT-ND
R6 = RC0805FR-073K16L: RES SMD 3.16K OHM 1% 1/8W 0805; Manufacturer: Yageo; Resistance: 3.16 kOhms; Power Rating: 125 mW (1/8 W); Temperature Coefficient: 100 PPM / C; Voltage Rating: 150 V; Unit Weight: 0.000194 oz; Supplier 1: Digi-Key; Manufacturer Part Number: RC0805FR-073K16L; Stock 1: 66271; Pricing 1: 1=0.1, 10=0.022, 100=0.0088, 1000=0.004, 2500=0.0034 (USD); Product Category: Thick Film Resistors; RoHS: True; Brand: Yageo; Tolerance: 1 %; Case Code - in: 0805; Case Code - mm: 2012; Operating Temperature Range: - 55 C to + 155 C; Series: RC; Height: 0.5 mm; Length: 2 mm; Package / Case: 0805 (2012 metric); Packaging: Reel; Product: Thick Film Resistors General Purpose; Termination Style: SMD/SMT; Type: General Purpose Chip Resistor Surface Mount; Width: 1.25 mm; ComponentLink1URL: https://datasheet.ciiva.com/2457/pyu-r-int-thick-7-2457284.pdf; ComponentLink1Description: https://datasheet.ciiva.com/2457/pyu-r-int-thick-7-2457284.pdf; ComponentLink2URL: https://datasheet.ciiva.com/2457/pyu-r-int-thick-7-2457285.pdf; ComponentLink2Description: https://datasheet.ciiva.com/2457/pyu-r-int-thick-7-2457285.pdf; ComponentLink3URL: https://datasheet.ciiva.com/2457/pyu-r-int-thick-7-2457286.pdf; ComponentLink3Description: https://datasheet.ciiva.com/2457/pyu-r-int-thick-7-2457286.pdf; ComponentLink4URL: https://datasheet.ciiva.com/12577/rc0805-12577436.pdf; ComponentLink4Description: https://datasheet.ciiva.com/12577/rc0805-12577436.pdf; Supplier Part Number 1: 311-3.16KCRCT-ND
R9-R14 = RC0805JR-07560RL: RES SMD 560 OHM 5% 1/8W 0805; Manufacturer: Yageo; Resistance: 560 Ohms; Power Rating: 125 mW (1/8 W); Voltage Rating: 150 V; Temperature Coefficient: 100 PPM / C; Supplier 1: Digi-Key; Manufacturer Part Number: RC0805JR-07560RL; Stock 1: 266046; Pricing 1: 1=0.1, 10=0.019, 100=0.0076, 1000=0.0034, 2500=0.003 (USD); Termination Style: SMD/SMT; Product: Thick Film Resistors General Purpose; Tolerance: 5 %; Case Code - in: 0805; Case Code - mm: 2012; Series: RC; Operating Temperature Range: - 55 C to + 155 C; Packaging: Reel; ComponentLink1URL: https://datasheet.ciiva.com/12656/rc0805-12656805.pdf; ComponentLink1Description: https://datasheet.ciiva.com/12656/rc0805-12656805.pdf; ComponentLink2URL: https://datasheet.ciiva.com/7941/442941-7941977.pdf; ComponentLink2Description: https://datasheet.ciiva.com/7941/442941-7941977.pdf; ComponentLink3URL: https://datasheet.ciiva.com/2491/pyu-r-int-thick-7-2491354.pdf; ComponentLink3Description: https://datasheet.ciiva.com/2491/pyu-r-int-thick-7-2491354.pdf; ComponentLink4URL: https://datasheet.ciiva.com/7941/442941-7941978.pdf; ComponentLink4Description: https://datasheet.ciiva.com/7941/442941-7941978.pdf; ComponentLink5URL: https://datasheet.ciiva.com/2491/pyu-r-int-thick-7-2491355.pdf; ComponentLink5Description: https://datasheet.ciiva.com/2491/pyu-r-int-thick-7-2491355.pdf; ComponentLink6URL: https://datasheet.ciiva.com/2491/pyu-r-int-thick-7-2491356.pdf; ComponentLink6Description: https://datasheet.ciiva.com/2491/pyu-r-int-thick-7-2491356.pdf; ComponentLink7URL: https://datasheet.ciiva.com/17044/rc0805-17044479.pdf; ComponentLink7Description: https://datasheet.ciiva.com/17044/rc0805-17044479.pdf; Supplier Part Number 1: 311-560ARCT-ND
U1 = ICM-20602: WORLD'S BEST 6-AXIS INTEGRATED S; Manufacturer: InvenSense; Sensor Type: Accelerometer, Gyroscope, Temperature, 6 Axis; Output Type: I²C, SPI; Supplier 1: Digi-Key; Manufacturer Part Number: ICM-20602; Stock 1: 2576; Pricing 1: 1=5.72, 5=5.05, 10=4.46, 25=3.6184, 50=3.1978, 100=3.1136, 500=2.6087, 1000=2.4404 (USD); Category: Sensors, Transducers; Family: Multifunction; Series: -; Operating Temperature: -40°C ~ 85°C (TA); Supplier Part Number 1: 1428-1060-1-ND
U2 U4 = TL1963A-33DCQR: IC REG LDO 3.3V 1.5A SOT223-6; Manufacturer: Texas Instruments; Regulator Output Type: Fixed; Polarity Type: Positive; Number of Outputs: 1; Input Voltage (Min): 1.9V; Input Voltage: 20V; Load Regulation: 20mV; Line Regulation: 10mV; Supplier 1: Digi-Key; Manufacturer Part Number: TL1963A-33DCQR; Stock 1: 1510; Pricing 1: 1=2.95, 10=2.648, 100=2.1692, 500=1.8466, 1000=1.5574 (USD); Voltage Regulator Type: LDO; Topology: LDO; Output Voltage: 3.3V; Package Type: SOT-223; Packaging: Tape and Reel; Output Current: 1.5A; Operating Temp Range: -40C to 125C; Operating Temperature Classification: Automotive; Pin Count: 5 +Tab; Mounting: Surface Mount; ComponentLink1URL: https://datasheet.ciiva.com/2046/tl1963a-2046161.pdf; ComponentLink1Description: https://datasheet.ciiva.com/2046/tl1963a-2046161.pdf; ComponentLink2URL: https://datasheet.ciiva.com/2046/tl1963a-2046162.pdf; ComponentLink2Description: https://datasheet.ciiva.com/2046/tl1963a-2046162.pdf; ComponentLink3URL: https://datasheet.ciiva.com/2046/tl1963a-2046163.pdf; ComponentLink3Description: https://datasheet.ciiva.com/2046/tl1963a-2046163.pdf; ComponentLink4URL: https://datasheet.ciiva.com/26176/tl1963a-25-26176569.pdf; ComponentLink4Description: https://datasheet.ciiva.com/26176/tl1963a-25-26176569.pdf; Supplier Part Number 1: 296-24534-1-ND
U3 = STM32F446RET6: STMICROELECTRONICS         STM32F446RET6             32 Bit Microcontroller, High Performance, ARM Cortex-M4, 180 MHz, 512 KB, 128 KB, 64 Pins, LQFP; Device Core: ARM Cortex M4; Maximum Operating Supply Voltage: 3.6 V; Data Bus Width: 32 Bit; RAM Size: 132 KB; Interface Type: CAN/I2C/I2S/SPI/UART/USART/USB; Screening Level: Extended Industrial; Instruction Set Architecture: RISC; Program Memory Type: Flash; Minimum Operating Supply Voltage: 1.7 V; Number of Timers: 14; Operating Supply Voltage: 2.5|3.3 V; On-Chip ADC: 2(16-chx12-bit); Watchdog: 2; On-Chip DAC: 2-chx12bit; Maximum Power Dissipation: 345 mW; Maximum Speed: 180 MHz; Program Memory Size: 512 KB; Number of Programmable I/Os: 50; Special Features: CAN Controller; Supplier 1: Digi-Key; Manufacturer: STMicroelectronics; Manufacturer Part Number: STM32F446RET6; Stock 1: 1212; Pricing 1: 1=8.59, 10=7.762, 100=6.4258, 500=5.5955, 1000=4.8735 (USD); Mounting: Surface Mount; Operating Temperature: -40 to 105 C; ComponentLink1URL: http://www.st.com/st-web-ui/static/active/en/resource/technical/document/datasheet/DM00141306.pdf; ComponentLink1Description: http://www.st.com/st-web-ui/static/active/en/resource/technical/document/datasheet/DM00141306.pdf; ComponentLink2URL: http://www.st.com/content/ccc/resource/technical/document/datasheet/65/cb/75/50/53/d6/48/24/DM00141306.pdf/files/DM00141306.pdf/jcr:content/translations/en.DM00141306.pdf; ComponentLink2Description: http://www.st.com/content/ccc/resource/technical/document/datasheet/65/cb/75/50/53/d6/48/24/DM00141306.pdf/files/DM00141306.pdf/jcr:content/translations/en.DM00141306.pdf; ComponentLink3URL: http://www.farnell.com/datasheets/1997805.pdf; ComponentLink3Description: http://www.farnell.com/datasheets/1997805.pdf; Supplier Part Number 1: 497-15376-ND
U5 = FT232RL-REEL: IC USB FS SERIAL UART 28-SSOP; Manufacturer: FTDI; Number of Channels: 1; Transmit FIFO: 256Byte; Receive  FIFO: 128Byte; Interface Circuit Standard 1: RS-232/RS-422/RS-485; Transmitter and Receiver FIFO Counter: No; Operating Supply Voltage (Typ): 5V; Operating Supply Voltage (Max): 5.25V; Operating Supply Voltage (Min): 3.3V; Supply Current: 15(Typ)mA; Supplier 1: Digi-Key; Manufacturer Part Number: FT232RL-REEL; Stock 1: 133923; Pricing 1: 1=4.5, 10=4.05, 100=3.65, 250=3.25, 500=2.85, 1000=2.65 (USD); Package Type: SSOP; Packaging: Tape and Reel; Mounting: Surface Mount; Pin Count: 28; Operating Temperature (Min): -40C; Operating Temperature (Max): 85C; Operating Temperature Classification: Industrial; ComponentLink1URL: https://datasheet.ciiva.com/34304/2161019-34304054.pdf; ComponentLink1Description: https://datasheet.ciiva.com/34304/2161019-34304054.pdf; ComponentLink2URL: https://datasheet.ciiva.com/1787/ds-ft232r-1787047.pdf; ComponentLink2Description: https://datasheet.ciiva.com/1787/ds-ft232r-1787047.pdf; ComponentLink3URL: https://datasheet.ciiva.com/1787/ds-ft232r-1787048.pdf; ComponentLink3Description: https://datasheet.ciiva.com/1787/ds-ft232r-1787048.pdf; ComponentLink4URL: https://datasheet.ciiva.com/1787/ds-ft232r-1787049.pdf; ComponentLink4Description: https://datasheet.ciiva.com/1787/ds-ft232r-1787049.pdf; ComponentLink5URL: https://datasheet.ciiva.com/4787/ds-ft232r-11534-4787658.pdf; ComponentLink5Description: https://datasheet.ciiva.com/4787/ds-ft232r-11534-4787658.pdf; ComponentLink6URL: https://datasheet.ciiva.com/15150/getdatasheetpartid-643207-15150506.pdf; ComponentLink6Description: https://datasheet.ciiva.com/15150/getdatasheetpartid-643207-15150506.pdf; ComponentLink7URL: https://datasheet.ciiva.com/16200/ds-ft232r-16200652.pdf; ComponentLink7Description: https://datasheet.ciiva.com/16200/ds-ft232r-16200652.pdf; ComponentLink8URL: https://datasheet.ciiva.com/26841/ft232rl-reel-26841080.pdf; ComponentLink8Description: https://datasheet.ciiva.com/26841/ft232rl-reel-26841080.pdf; Supplier Part Number 1: 768-1007-1-ND
Y1 = ABM7-24.000MHZ-D2Y-T: ABRACON         ABM7-24.000MHZ-D2Y-T             CRYSTAL, 24MHZ, 18PF, 6 X 3.5MM; Catalog Drawings: ABM7 Series Top / ABM7 Series Side / ABM7 Series Bottom; Featured Product: ABM7 and ABM11 Crystals; 3D Model: ABM7.pdf / ABM7.stp; Frequency Stability: ±30ppm; Frequency Tolerance: ±20ppm; ESR (Equivalent Series Resistance): 50 Ohm; Operating Mode: Fundamental; Online Catalog: ABM7 Series; Other Names: 535-9845-1; Supplier 1: Digi-Key; Manufacturer: Abracon; Manufacturer Part Number: ABM7-24.000MHZ-D2Y-T; Stock 1: 33141; Pricing 1: 1=0.72, 10=0.633, 50=0.5912, 100=0.5225, 500=0.495 (USD); RoHS Information: RoHS2/REACH Compliance; Standard Package: 1; Category: Crystals and Oscillators; Family: Crystals; Series: ABM7; Packaging: Cut Tape (CT); Type: MHz Crystal; Frequency: 24MHz; Load Capacitance: 18pF; Operating Temperature: -40°C ~ 85°C; Mounting Type: Surface Mount; Package / Case: 2-SMD; Size / Dimension: 0.236" L x 0.138" W (6.00mm x 3.50mm); Height: 0.055" (1.40mm); ComponentLink1URL: https://datasheet.ciiva.com/15116/getdatasheetpartid-635354-15116657.pdf; ComponentLink1Description: https://datasheet.ciiva.com/15116/getdatasheetpartid-635354-15116657.pdf; ComponentLink2URL: https://datasheet.ciiva.com/29882/abm10-29882758.pdf; ComponentLink2Description: https://datasheet.ciiva.com/29882/abm10-29882758.pdf; ComponentLink3URL: https://datasheet.ciiva.com/46394/947971-46394791.pdf; ComponentLink3Description: https://datasheet.ciiva.com/46394/947971-46394791.pdf; ComponentLink4URL: https://datasheet.ciiva.com/4944/abm7-19096-4944473.pdf; ComponentLink4Description: https://datasheet.ciiva.com/4944/abm7-19096-4944473.pdf; ComponentLink5URL: https://datasheet.ciiva.com/1357/947971-1357274.pdf; ComponentLink5Description: https://datasheet.ciiva.com/1357/947971-1357274.pdf; ComponentLink6URL: https://datasheet.ciiva.com/18649/abm7-18649883.pdf; ComponentLink6Description: https://datasheet.ciiva.com/18649/abm7-18649883.pdf; ComponentLink7URL: https://datasheet.ciiva.com/16741/abm7-16741964.pdf; ComponentLink7Description: https://datasheet.ciiva.com/16741/abm7-16741964.pdf; ComponentLink8URL: https://datasheet.ciiva.com/18649/abm7-18649884.pdf; ComponentLink8Description: https://datasheet.ciiva.com/18649/abm7-18649884.pdf; ComponentLink9URL: https://datasheet.ciiva.com/18649/abm7-18649885.pdf; ComponentLink9Description: https://datasheet.ciiva.com/18649/abm7-18649885.pdf; ComponentLink10URL: https://datasheet.ciiva.com/7998/947971-7998607.pdf; ComponentLink10Description: https://datasheet.ciiva.com/7998/947971-7998607.pdf; Supplier Part Number 1: 535-9845-1-ND